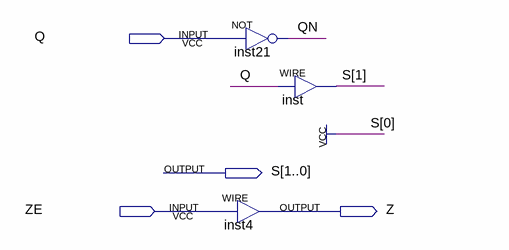
[diagram p0: schematic sheet]
// Quartus schematic OUTPUTLOGIC.bdf as structural Verilog: 3 symbols, 4 pins
module OUTPUTLOGIC (
  input  Q,
  input  ZE,
  output [1:0] S,
  output Z
);

  wire QN;

  not inst21 (QN, Q);
  assign S[1] = Q;  // WIRE inst
  assign Z = ZE;  // WIRE inst4

  assign S[0] = 1'b1;
endmodule
